# Altium schematic sheet POWER_SUPPLY.SchDoc
size 292 x 294 mm; SheetNumber: 4; SheetTotal: 6
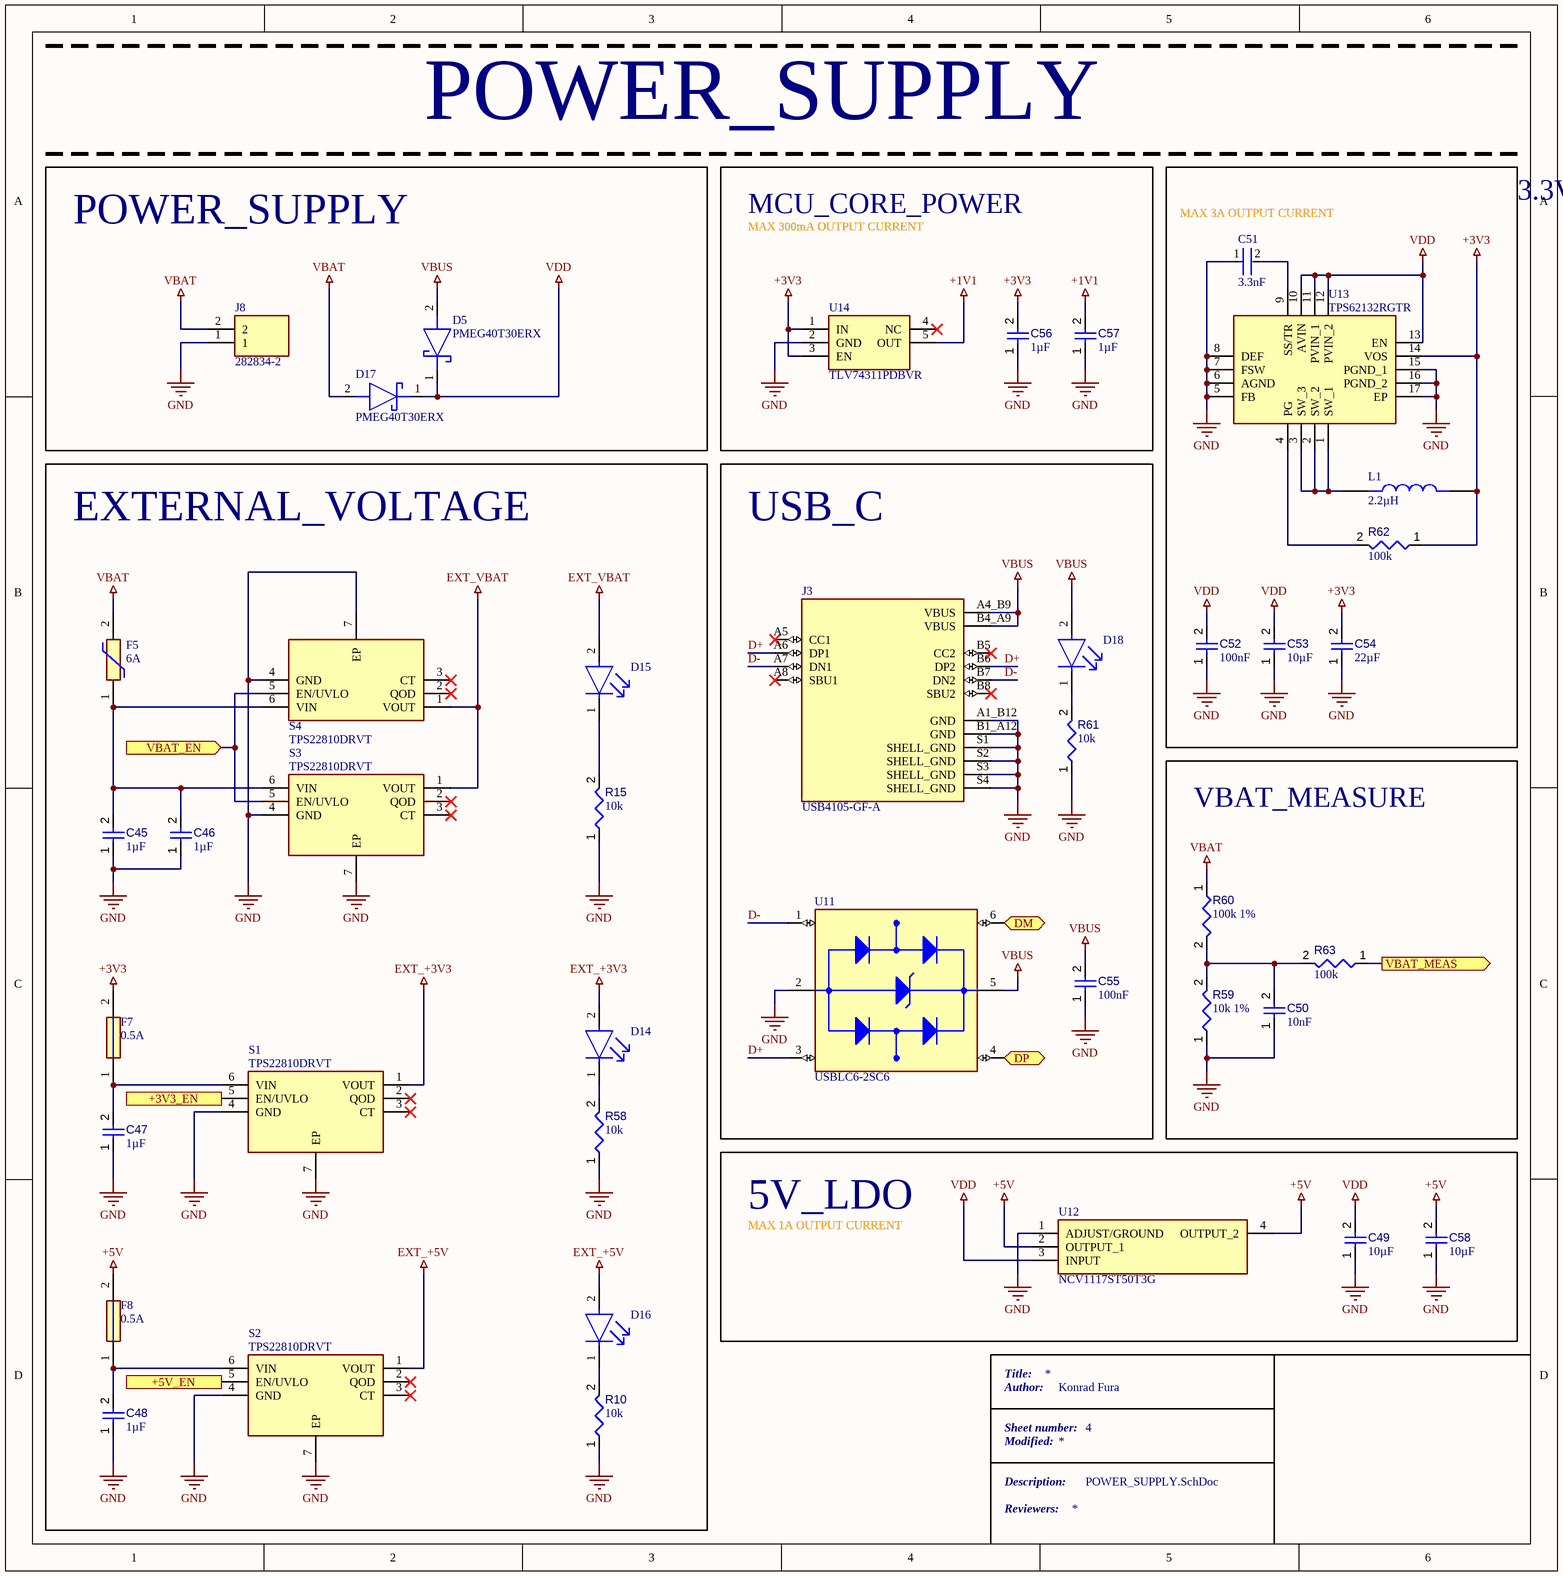
[diagram p0: POWER_SUPPLY.SchDoc]

## Parts
C45  value 1µF  [CAPC0402(1005)60_L]  (hidden comment: Capacitor 1µF +/-20% 10V 0402)
C46  value 1µF  [CAPC0402(1005)60_L]  (hidden comment: Capacitor 1µF +/-20% 10V 0402)
C47  value 1µF  [CAPC0402(1005)60_L]  (hidden comment: Capacitor 1µF +/-20% 10V 0402)
C48  value 1µF  [CAPC0402(1005)60_L]  (hidden comment: Capacitor 1µF +/-20% 10V 0402)
C49  value 10µF  [CAPC0603(1608)100_L]  (hidden comment: Capacitor 10µF +/-20% 10V 0603)
C50  value 10nF  [CAPC0402(1005)60_L]  (hidden comment: Capacitor 10nF +/-20% 50V 0402)
C51  3.3nF  [FP-CL388-IPC_C]
C52  value 100nF  [CAPC0402(1005)60_L]  (hidden comment: Capacitor 100nF +/-20% 10V 0402)
C53  value 10µF  [CAPC0603(1608)100_L]  (hidden comment: Capacitor 10µF +/-20% 10V 0603)
C54  value 22µF  [CAPC0805(2012)145_L]  (hidden comment: Capacitor 22µF +/-40% 16V 0805)
C55  value 100nF  [CAPC0402(1005)60_L]  (hidden comment: Capacitor 100nF +/-20% 10V 0402)
C56  value 1µF  [CAPC0402(1005)60_L]  (hidden comment: Capacitor 1µF +/-20% 10V 0402)
C57  value 1µF  [CAPC0402(1005)60_L]  (hidden comment: Capacitor 1µF +/-20% 10V 0402)
C58  value 10µF  [CAPC0603(1608)100_L]  (hidden comment: Capacitor 10µF +/-20% 10V 0603)
D5  PMEG40T30ERX  [SODFL3517X110N]
D14  (no value)  [FP-LTST-C191TBKT-MFG]
D15  (no value)  [FP-LTST-C191TBKT-MFG]
D16  (no value)  [FP-LTST-C191TBKT-MFG]
D17  PMEG40T30ERX  [SODFL3517X110N]
D18  (no value)  [FP-LTST-C191TBKT-MFG]
F5  6A  [1206L075SLYR]
F7  0.5A  [FUSC2114X75N]
F8  0.5A  [FUSC2114X75N]
J3  USB4105-GF-A  [GCT_USB4105-GF-A]
J8  282834-2  [282834-2_1]
L1  2.2µH  [IND_XFL4020-102MEC]
R10  value 10k  [RESC0402(1005)_L]  (hidden comment: Resistor 10K  +/-1 % 0402 63 mW)
R15  value 10k  [RESC0402(1005)_L]  (hidden comment: Resistor 10K  +/-1 % 0402 63 mW)
R58  value 10k  [RESC0402(1005)_L]  (hidden comment: Resistor 10K  +/-1 % 0402 63 mW)
R59  value 10k 1%  [RESC0402(1005)_L]  (hidden comment: Resistor 10K  +/-1 % 0402 63 mW)
R60  value 100k 1%  [RESC0402(1005)_L]  (hidden comment: Resistor 100K +/-1 % 0402 63 mW)
R61  value 10k  [RESC0402(1005)_L]  (hidden comment: Resistor 10K  +/-1 % 0402 63 mW)
R62  value 100k  [RESC0402(1005)_L]  (hidden comment: Resistor 100K +/-1 % 0402 63 mW)
R63  value 100k  [RESC0402(1005)_L]  (hidden comment: Resistor 100K +/-1 % 0402 63 mW)
S1  TPS22810DRVT  [SON65P200X200X80-7N]
S2  TPS22810DRVT  [SON65P200X200X80-7N]
S3  TPS22810DRVT  [SON65P200X200X80-7N]
S4  TPS22810DRVT  [SON65P200X200X80-7N]
U11  USBLC6-2SC6  [SOT95P280X145-6N]
U12  NCV1117ST50T3G  [SOT230P700X180-4N]
U13  TPS62132RGTR  [QFN50P300X300X100-17N-D]
U14  TLV74311PDBVR  [SOT95P280X145-5N]

## Blocks framed on the sheet
POWER_SUPPLY: D5 D17 J8
MCU_CORE_POWER: C56 C57 U14
MAX 3A OUTPUT CURRENT: C51-C54 L1 R62 U13
EXTERNAL_VOLTAGE: C45-C48 D14-D16 F5 F7 F8 R10 R15 R58 S1-S4
USB_C: C55 D18 J3 R61 U11
VBAT_MEASURE: C50 R59 R60 R63
5V_LDO: C49 C58 U12

## Ports
+3V3_EN (in, see SYSTEM_OVERVIEW[4C], MCU[3B]), +5V_EN (in, see SYSTEM_OVERVIEW[4C], MCU[3B]), DM (bidir, see SYSTEM_OVERVIEW[4C], MCU[2A]), DP (bidir, see SYSTEM_OVERVIEW[4C], MCU[2A]), VBAT_EN (in, see SYSTEM_OVERVIEW[4C], MCU[3B]), VBAT_MEAS (out, see SYSTEM_OVERVIEW[4C], MCU[3C])

## Nets
+1V1: C57.2 U14.5(OUT)
+3V3: C54.2 C56.2 F7.2 L1.1 R62.1 U13.14(VOS) U14.1(IN) U14.3(EN)
+5V: C58.2 F8.2 U12.2(OUTPUT_1) U12.4(OUTPUT_2)
EXT_+3V3: D14.2(A) S1.1(VOUT)
EXT_+5V: D16.2(A) S2.1(VOUT)
EXT_VBAT: D15.2(A) S3.1(VOUT) S4.1(VOUT)
GND: C45.1 C46.1 C47.1 C48.1 C49.1 C50.1 C51.1 C52.1 C53.1 C54.1 C55.1 C56.1 C57.1 C58.1 J3.A1_B12(GND) J3.B1_A12(GND) J3.S1(SHELL_GND) J3.S2(SHELL_GND) J3.S3(SHELL_GND) J3.S4(SHELL_GND) J8.1 R10.1 R15.1 R58.1 R59.1 R61.1 S1.4(GND) S1.7(EP) S2.4(GND) S2.7(EP) S3.4(GND) S3.7(EP) S4.4(GND) S4.7(EP) U11.2(GND) U12.1(ADJUST/GROUND) U13.5(FB) U13.6(AGND) U13.7(FSW) U13.8(DEF) U13.15(PGND_1) U13.16(PGND_2) U13.17(EP) U14.2(GND)
VBAT: D17.2(A) F5.2 J8.2 R60.1
VBUS: C55.2 D5.2(A) D18.2(A) J3.A4_B9(VBUS) J3.B4_A9(VBUS) U11.5(VBUS)
VDD: C49.2 C52.2 C53.2 D5.1(K) D17.1(K) U12.3(INPUT) U13.10(AVIN) U13.11(PVIN_1) U13.12(PVIN_2) U13.13(EN)
+3V3_EN: S1.5(EN/UVLO) ; port +3V3_EN
+5V_EN: S2.5(EN/UVLO) ; port +5V_EN
D+: J3.A6(DP1) J3.B6(DP2) U11.3(I/O2_IN)
D-: J3.A7(DN1) J3.B7(DN2) U11.1(I/O1_IN)
DM: U11.6(I/O1_OUT) ; port DM
DP: U11.4(I/O2_OUT) ; port DP
VBAT_EN: S3.5(EN/UVLO) S4.5(EN/UVLO) ; port VBAT_EN
VBAT_MEAS: R63.1 ; port VBAT_MEAS
NetC45_2: C45.2 C46.2 F5.1 S3.6(VIN) S4.6(VIN)
NetC47_2: C47.2 F7.1 S1.6(VIN)
NetC48_2: C48.2 F8.1 S2.6(VIN)
NetC50_2: C50.2 R59.2 R60.2 R63.2
NetC51_2: C51.2 U13.9(SS/TR)
NetD14_1: D14.1(C) R58.2
NetD15_1: D15.1(C) R15.2
NetD16_1: D16.1(C) R10.2
NetD18_1: D18.1(C) R61.2
NetL1_2: L1.2 U13.1(SW_1) U13.2(SW_2) U13.3(SW_3)
NetR62_2: R62.2 U13.4(PG)

Not connected (* = marked no-connect by the designer): J3 A5(CC1)* A8(SBU1)* B5(CC2)* B8(SBU2)*; S1 2(QOD)* 3(CT)*; S2 2(QOD)* 3(CT)*; S3 2(QOD)* 3(CT)*; S4 2(QOD)* 3(CT)*; U14 4(NC)*

## Notes on the sheet
- POWER_SUPPLY
- MAX 300mA OUTPUT CURRENT
- 3.3V BUCK_CONVERTER
- MAX 1A OUTPUT CURRENT
- Title:
- Author:
- Konrad Fura
- Sheet number:
- Modified:
- Description:
- Reviewers:

## Library data of the parts
C45-C48 C56 C57 = CMP-001-00063-3: Chip Capacitor, 1µF +/-20%, 10V, 0402, Thickness 0.6 mm; Tolerance: 10%; Mounting Technology: SMT; Max Operating Temperature: 85°C; Voltage Rating: 10V; Pins: 2; Case/Package: 0402; Min Operating Temperature: -55°C
C49 C53 C58 = CMP-001-00075-4: Chip Capacitor, 10µF +/-20%, 10V, 0603, Thickness 1 mm; Tolerance: 10%; Voltage Rating: 10V; Max Operating Temperature: 85°C; Pins: 2; Case/Package: 0603; Mounting Technology: SMT; Min Operating Temperature: -55°C
C50 = CMP-001-00069-3: Chip Capacitor, 10nF +/-20%, 50V, 0402, Thickness 0.6 mm; Tolerance: 5%; Max Operating Temperature: 85°C; Pins: 2; Case/Package: 0402; Voltage Rating: 50V; Min Operating Temperature: -55°C; Mounting Technology: SMT
C51 = CMP-13271-000627-1: Cap Ceramic 3.3nF 50V X7R ±10% SMD 0402 +125°C Paper T/R; Voltage Rating: 50V; Packaging: Tape and Reel; Mount: Surface Mount; Height: 0.5mm; Dielectric: X7R; Depth: 0.5mm; Tolerance: 10%; Voltage Rating (DC): 50V; Lead Free: Lead Free; Radiation Hardening: No; Thickness: 0.022inch; Case/Package: 0402; Width: 0.02inch; Contact Plating: Tin; Max Operating Temperature: 125°C; Length: 1mm; Case Code (Imperial): 0402; Capacitance: 3.3nF; Voltage: 50V; Case Code (Metric): 1005; Min Operating Temperature: -55°C; Package Quantity: 1; Material: Ceramic
C52 C55 = CMP-001-00061-3: Chip Capacitor, 100nF +/-20%, 10V, 0402, Thickness 0.6 mm; Tolerance: 20%; Mounting Technology: SMT; Voltage Rating: 10V; Max Operating Temperature: 85°C; Pins: 2; Case/Package: 0402; Min Operating Temperature: -55°C
C54 = CMP-001-00081-4: Chip Capacitor, 22µF +/-40%, 16V, 0805, Thickness 1.45 mm; Tolerance: 5%; Voltage Rating: 16V; Mounting Technology: SMT; Pins: 2; Max Operating Temperature: 85°C; Case/Package: 0805; Min Operating Temperature: -55°C
D5 D17 = PMEG60T30ELRX: Schottky Diode; Manufacturer_Name: Nexperia; Datasheet Link: https://assets.nexperia.com/documents/data-sheet/PMEG60T30ELR.pdf; Height: 1.1mm; Manufacturer_Part_Number: PMEG60T30ELRX; Mouser Part Number: 771-PMEG60T30ELRX; Mouser Price/Stock: https://www.mouser.co.uk/ProductDetail/Nexperia/PMEG60T30ELRX?qs=MLItCLRbWswWnbT%2FWpJcxg%3D%3D; Arrow Part Number: PMEG60T30ELRX; Arrow Price/Stock: https://www.arrow.com/en/products/pmeg60t30elrx/nexperia?region=nac
D14-D16 D18 = CMP-22017-000008-1: LED BLUE CLEAR CHIP SMD; Lens Color: Colorless; Dominant Wavelength: 475nm; Forward Current: 20mA; Wavelength: 468nm; Viewing Angle: 130°; Power Dissipation: 76mW; Luminous Intensity: 180mcd; Reverse Voltage: 5V; Number of Elements: 1; Lens Style: Diffused; Forward Voltage: 3.8V; Max Power Dissipation: 75mW; Case Code (Metric): 1608; Packaging: Tape and Reel; Case/Package: 0603; Depth: 1.6mm; Mount: Surface Mount; Lead Free: Lead Free; Min Operating Temperature: -20°C; Lens Transparency: Clear; Illumination Color: Blue; Height: 0.55mm; Test Current: 20mA; Case Code (Imperial): 0603; Max Operating Temperature: 80°C; Number of Pins: 2; Length: 0.8mm; Radiation Hardening: No; Package Quantity: 1; Number of LEDs: 1; Width: 0.8mm; Color: Blue
F5 = 1206L300_12SLYR: Resettable Fuse; Manufacturer_Name: LITTELFUSE; Manufacturer_Part_Number: 1206L300/12SLYR; Datasheet Link: https://www.littelfuse.com/~/media/electronics/datasheets/resettable_ptcs/littelfuse_ptc_low_rho_datasheet.pdf.pdf; Height: 0.7mm; Mouser Part Number: 576-1206L300/12SLYR; Mouser Price/Stock: https://www.mouser.co.uk/ProductDetail/Littelfuse/1206L300-12SLYR?qs=7MVldsJ5UayklLN9lruToA%3D%3D
F7 F8 = 0805L020_24YR: Fuse; Manufacturer_Name: LITTELFUSE; Manufacturer_Part_Number: 0805L020/24YR; Datasheet Link: https://m.littelfuse.com/media?resourcetype=datasheets&itemid=3b1fa5dc-24aa-4363-b543-edb057c2fffa&filename=littelfuse-ptc-0805l-datasheet; Height: 0.75mm; Mouser Part Number: 576-0805L020/24YR; Mouser Price/Stock: https://www.mouser.co.uk/ProductDetail/Littelfuse/0805L020-24YR?qs=AQlKX63v8Rtx0r%252BHTgklTQ%3D%3D
J3 = USB4105-GF-A: USB-C (USB TYPE-C) USB 2.0 Receptacle Connector 24 (16+8 Dummy) Position Surface Mount, Right Angle; Through Hole; MF: {'manufacturer': u'GCT'}; Package: None; Price: None; Value: *; MP: USB4105-GF-A; Availability: Unavailable
J8 = 282834-2: Connector; Manufacturer_Name: TE Connectivity; Datasheet Link: https://www.te.com/commerce/DocumentDelivery/DDEController?Action=srchrtrv&DocNm=1-1773458-1_EURO_STYLE_QRG&DocType=Data+Sheet&DocLang=English&PartCntxt=282834-2&DocFormat=pdf; Manufacturer_Part_Number: 282834-2; Mouser Part Number: 571-282834-2; Mouser Price/Stock: https://www.mouser.co.uk/ProductDetail/TE-Connectivity/282834-2?qs=A%252Bip%252BNCYi6N8cVKuk8xDog%3D%3D; Arrow Part Number: 282834-2; Arrow Price/Stock: https://www.arrow.com/en/products/282834-2/te-connectivity?region=europe
L1 = XFL4020-102MEC: Power inductor, shielded, 20% tol, SMT, RoHS, halogen free; MF: {'manufacturer': u'Coilcraft'}; Package: None; Price: None; Value: *; MP: XFL4020-102MEC; Availability: Unavailable
R10 R15 R58 R59 R61 = CMP-009-00149-3: Chip Resistor, 10 kOhms, +/-1 %, 63 mW, -55 to 125 degC, 0402; Power: 63mW; Tolerance: 1%; Min Operating Temperature: -55°C; Case/Package: 0402; Max Operating Temperature: 155°C; Pins: 2
R60 R62 R63 = CMP-009-00168-3: Chip Resistor, 100 kOhms, +/-1 %, 63 mW, -55 to 155 degC, 0402; Tolerance: 1%; Power: 63mW; Max Operating Temperature: 155°C; Min Operating Temperature: -55°C; Pins: 2; Case/Package: 0402
S1-S4 = TPS22810DRVT: Switch; Manufacturer_Name: Texas Instruments; Datasheet Link: http://www.ti.com/general/docs/lit/getliterature.tsp?genericPartNumber=TPS22810&fileType=pdf; Height: 0.8mm; Manufacturer_Part_Number: TPS22810DRVT; Mouser Part Number: 595-TPS22810DRVT; Mouser Price/Stock: https://www.mouser.co.uk/ProductDetail/Texas-Instruments/TPS22810DRVT?qs=5aG0NVq1C4wtEcND0E9Qlg%3D%3D; Arrow Part Number: TPS22810DRVT; Arrow Price/Stock: https://www.arrow.com/en/products/tps22810drvt/texas-instruments?region=nac
U11 = USBLC6-2SC6: <a href="https://pricing.snapeda.com/parts/USBLC6-2SC6/STMicroelectronics/view-part?ref=eda">Check availability</a>  <a href="https://pricing.snapeda.com/parts/USBLC6-2SC6/STMicroelectronics/view-part?ref=eda">Check availability</a>; MF: {'manufacturer': u'STMicroelectronics'}; Package: None; MP: USBLC6-2SC6; Value: *; Price: None; Availability: Unavailable
U12 = NCV1117ST50T3G: Integrated Circuit; Manufacturer_Name: onsemi; Datasheet Link: http://www.onsemi.com/pub/Collateral/NCP1117-D.PDF; Height: 1.8mm; Manufacturer_Part_Number: NCV1117ST50T3G; Mouser Part Number: 863-NCV1117ST50T3G; Mouser Price/Stock: https://www.mouser.co.uk/ProductDetail/onsemi/NCV1117ST50T3G?qs=bTNLGnZZEJgyYT%252BTIDEfYA%3D%3D; Arrow Part Number: NCV1117ST50T3G; Arrow Price/Stock: https://www.arrow.com/en/products/ncv1117st50t3g/on-semiconductor?region=nac
U13 = TPS62132RGTR: Integrated Circuit; Manufacturer_Name: Texas Instruments; Datasheet Link: http://www.ti.com/lit/gpn/tps62132; Height: 1mm; Manufacturer_Part_Number: TPS62132RGTR; Mouser Part Number: 595-TPS62132RGTR; Mouser Price/Stock: https://www.mouser.co.uk/ProductDetail/Texas-Instruments/TPS62132RGTR?qs=gXEV9p%2FxLgdM8Qvmd5pchA%3D%3D; Arrow Part Number: TPS62132RGTR; Arrow Price/Stock: https://www.arrow.com/en/products/tps62132rgtr/texas-instruments
U14 = TLV70311DBVR: Integrated Circuit; Manufacturer_Name: Texas Instruments; Datasheet Link: http://www.ti.com/lit/gpn/tlv703; Height: 1.45mm; Manufacturer_Part_Number: TLV70311DBVR; Mouser Part Number: 595-TLV70311DBVR; Mouser Price/Stock: https://www.mouser.co.uk/ProductDetail/Texas-Instruments/TLV70311DBVR?qs=YCa%2FAAYMW01QIBcdppGpKA%3D%3D; Arrow Part Number: TLV70311DBVR; Arrow Price/Stock: https://www.arrow.com/en/products/tlv70311dbvr/texas-instruments